# Altium project 喂鸟.PrjPCB
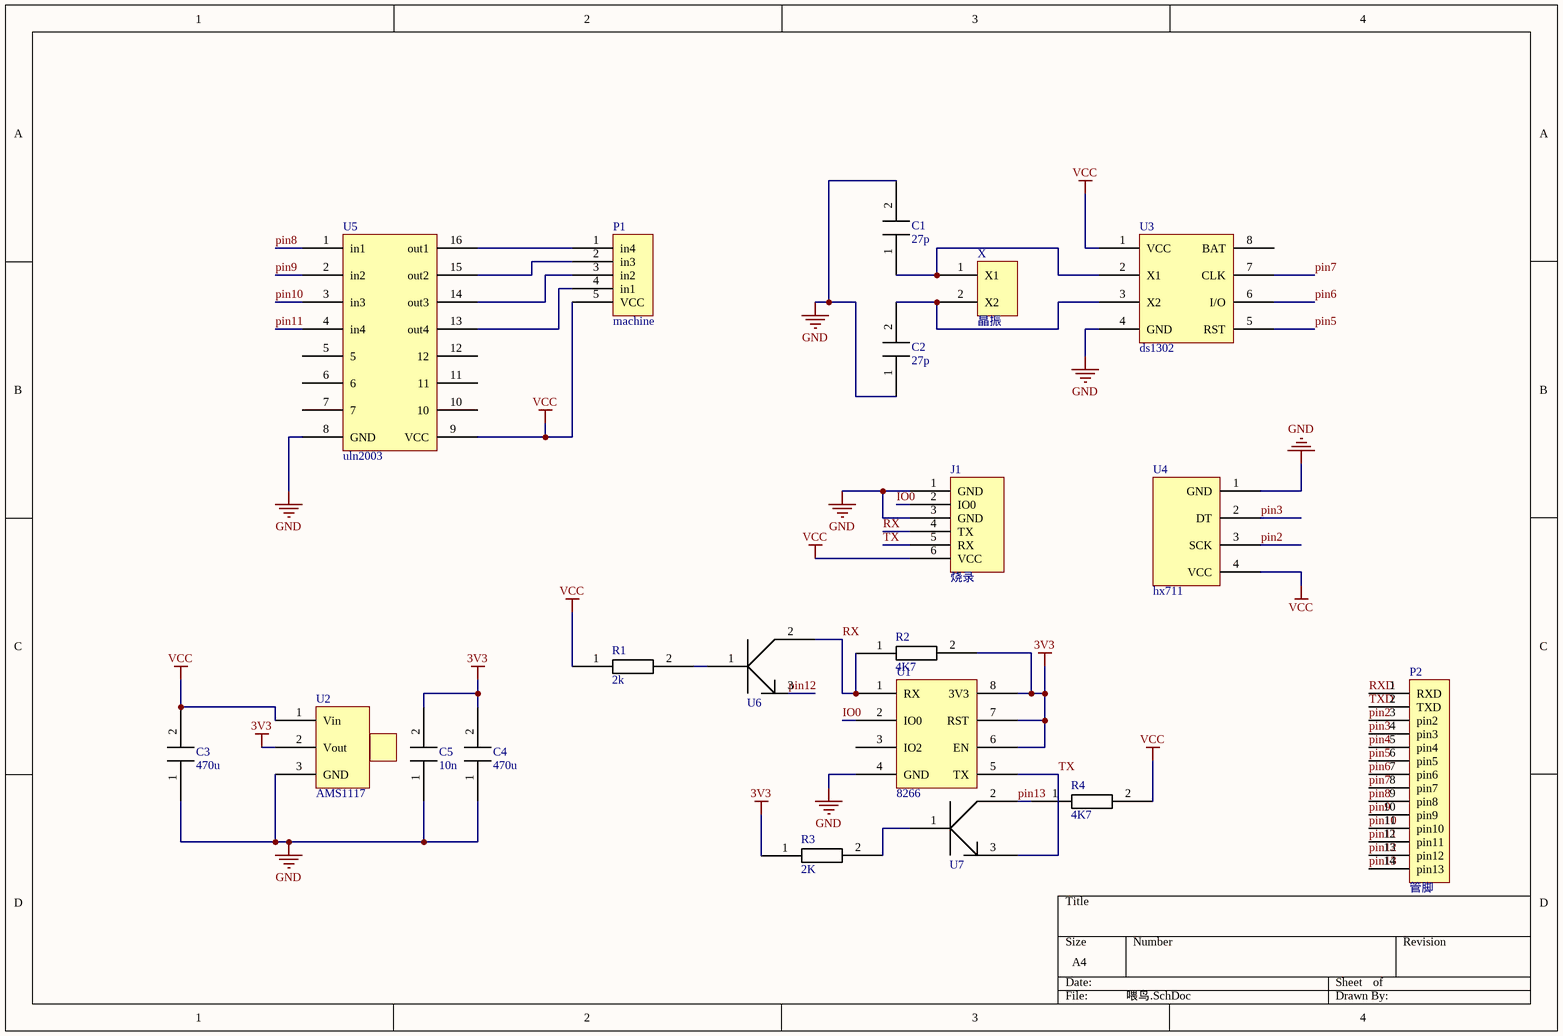
[diagram p0: 喂鸟.SchDoc]
1 sheet, 20 parts. Net scope: global (net labels, ports and power ports of the same name join across sheets).
Board file: 喂鸟.PcbDoc

## Sheet 喂鸟.SchDoc
size A4

### Parts
C1  27p  [C]
C2  27p  [C]
C3  470u  [0805]
C4  470u  [0805]
C5  10n  [0805]
J1  烧录
P1  machine  [machine]
P2  管脚  [接口]
R1  2k  [R]
R2  4K7  [R]
R3  2K  [R]
R4  4K7  [R]
U1  8266  [8266]
U2  AMS1117  [SOT223]
U3  ds1302  [DIP8]
U4  hx711  [HX711]
U5  uln2003  [DIP16]
U6  8050  [TO_92]  (value not drawn)
U7  8050  [TO_92]  (value not drawn)
X  晶振  [晶振]

### Nets
3V3: C4.2 C5.2 R2.2 R3.1 U1.6(EN) U1.7(RST) U1.8(3V3) U2.2(Vout)
GND: C1.2 C2.1 C3.1 C4.1 C5.1 J1.1(GND) J1.3(GND) U1.4(GND) U2.3(GND) U3.4(GND) U4.1(GND) U5.8(GND)
VCC: C3.2 J1.6(VCC) P1.5(VCC) R1.1 R4.2 U2.1(Vin) U3.1(VCC) U4.4(VCC) U5.9(VCC)
IO0: J1.2(IO0) U1.2(IO0)
pin2: P2.3(pin2) U4.3(SCK)
pin3: P2.4(pin3) U4.2(DT)
pin4: P2.5(pin4)
pin5: P2.6(pin5) U3.5(RST)
pin6: P2.7(pin6) U3.6(I/O)
pin7: P2.8(pin7) U3.7(CLK)
pin8: P2.9(pin8) U5.1(in1)
pin9: P2.10(pin9) U5.2(in2)
pin10: P2.11(pin10) U5.3(in3)
pin11: P2.12(pin11) U5.4(in4)
pin12: P2.13(pin12) U6.3
pin13: P2.14(pin13) R4.1 U7.2
RX: J1.4(TX) R2.1 U1.1(RX) U6.2
RXD: P2.1(RXD)
TX: J1.5(RX) U1.5(TX) U7.3
TXD: P2.2(TXD)
NetC1_1: C1.1 U3.2(X1) X.1(X1)
NetC2_2: C2.2 U3.3(X2) X.2(X2)
NetP1_1: P1.1(in4) U5.16(out1)
NetP1_2: P1.2(in3) U5.15(out2)
NetP1_3: P1.3(in2) U5.14(out3)
NetP1_4: P1.4(in1) U5.13(out4)
NetR1_2: R1.2 U6.1
NetR3_2: R3.2 U7.1

Not connected (* = marked no-connect by the designer): U1 3(IO2); U3 8(BAT); U5 5 6 7 10 11 12

### Library data of the parts
C1-C5 = C
R1-R4 = R